# EasyEDA Pro project ProDoc_Custom Keyboard_2025-10-23_RV1.epro, board PCB3
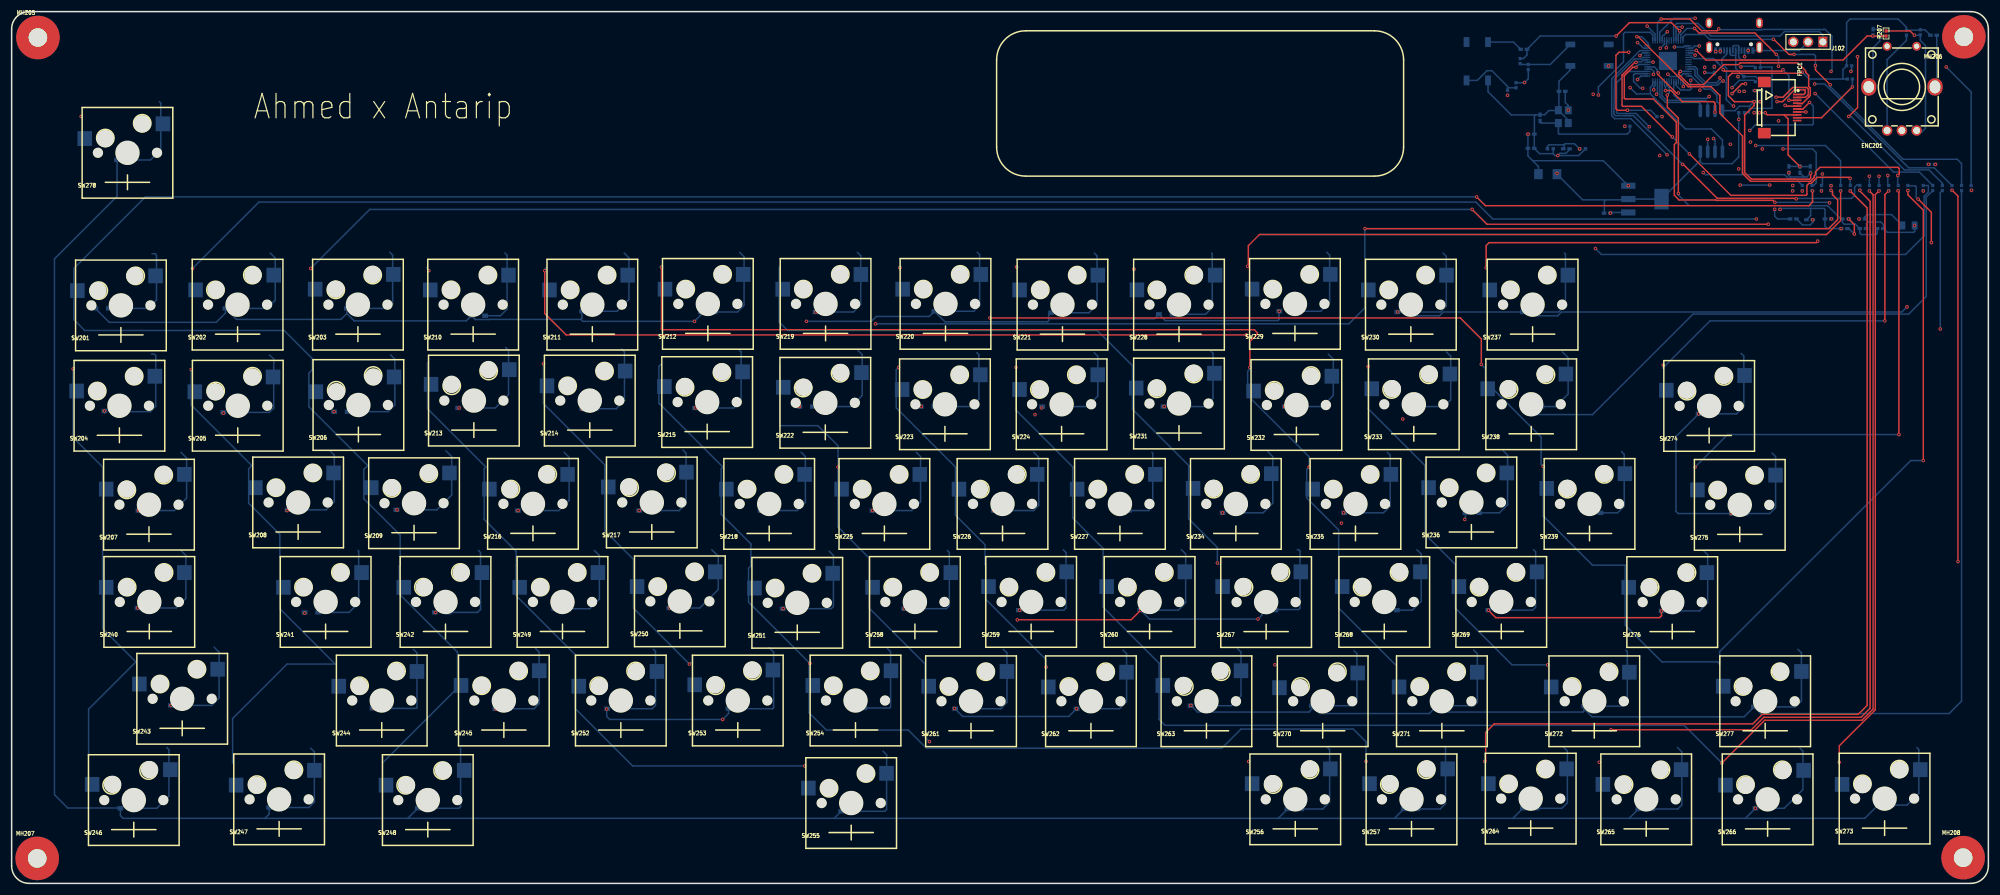
[diagram p2: board, top side]
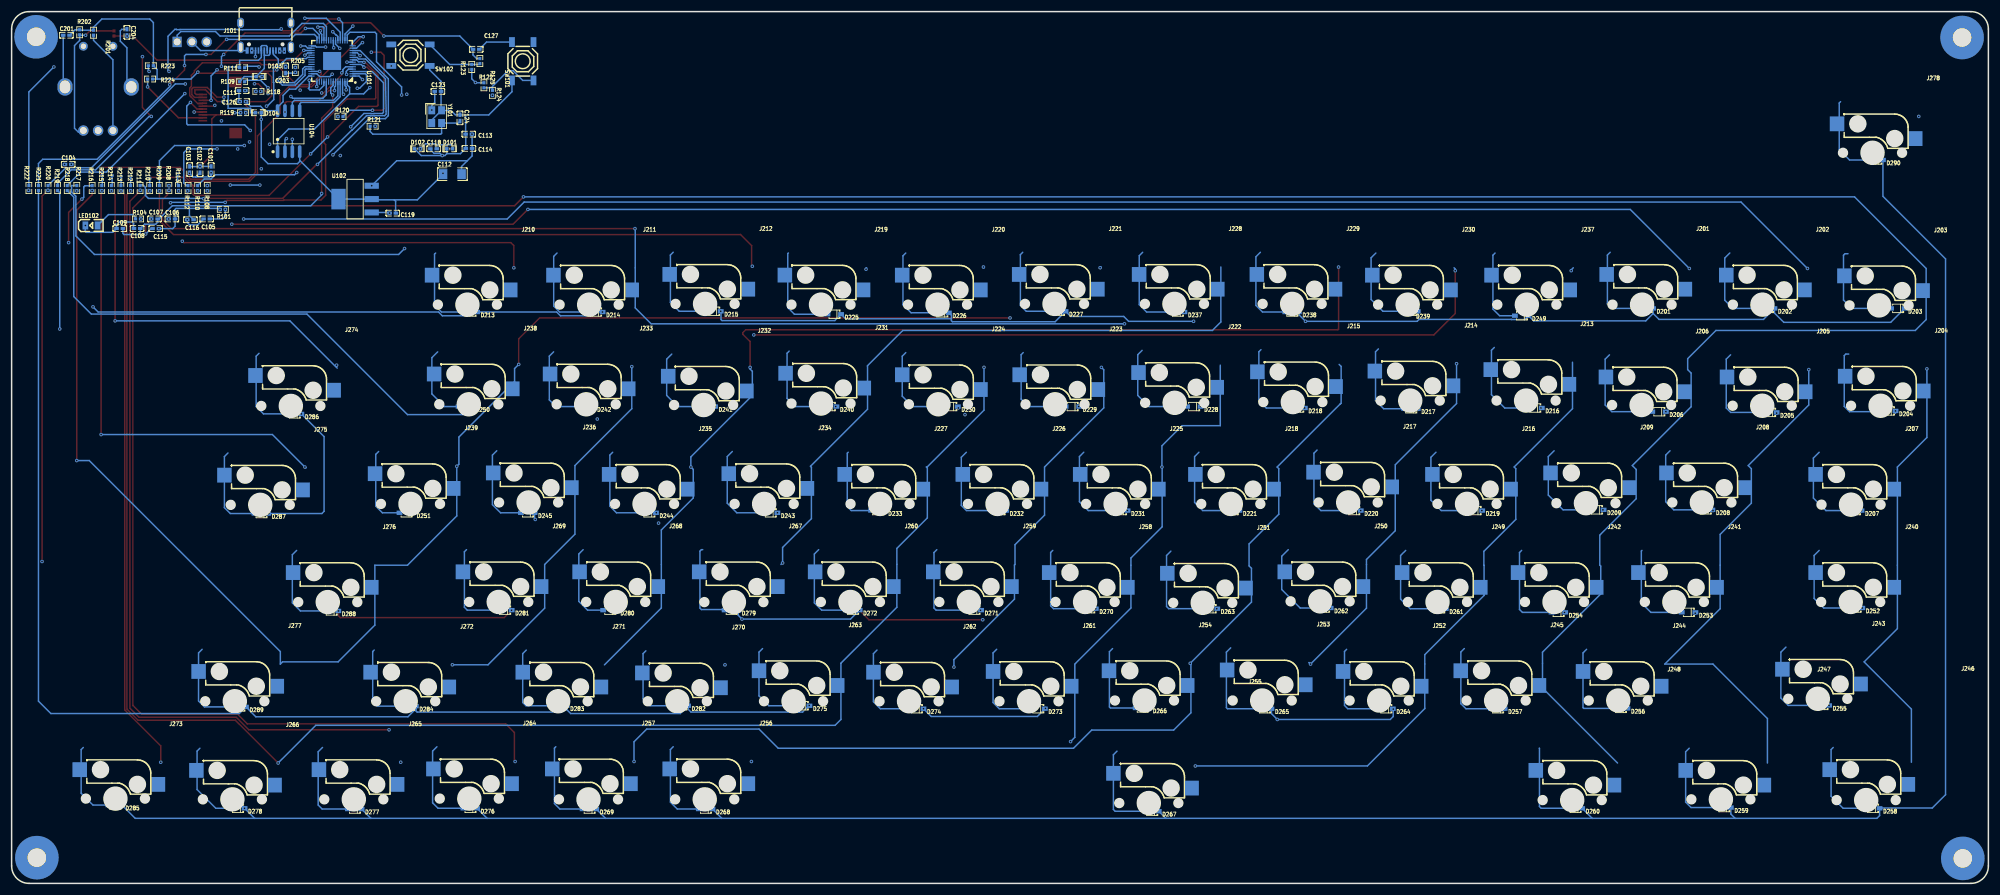
[diagram p3: board, bottom side, seen from below]

Outline 340 x 150 mm; copper layers: Top Layer, Inner1, Inner2, Bottom Layer. Coordinates in mm from the lower left corner of the outline.
Outline path: 0,147 0,3 arc(0.88,0.88) 3,0 337,0 arc(339.12,0.88) 340,3 340,147 arc(339.12,149.12) 337,150 3,150 arc(0.88,149.12) 0,147
Stack: Top Layer 0.035mm Outer layer thickness 1oz / Dielectric1 0.2104mm 7628 RC49% 8.6mil / Inner1 0.0152mm Inner layer thickness / Dielectric2 1.065mm 1.1mm H/HOZ Copper / Inner2 0.0152mm Inner layer thickness / Dielectric3 0.2104mm 7628 RC49% 8.6mil / Bottom Layer 0.035mm Outer layer thickness 1oz

## Design rules (mm)
net GND: DP2
net $2N1913: DP2
net SDA: DP1
net SCL: DP1
template: JLCPCB Capability(Two Layers Board)
spacing copperThickness1oz (default): track to track 0.102, other pairs 0.152 to 0.3
spacing copperThickness2oz: track to track 0.203, other pairs 0.152 to 0.3
track width copperThickness1oz (default): min 0.127, default 0.254, max 2.54
track width copperThickness2oz: min 0.203, default 0.254, max 2.54
differential pair differentialPair (default): width min 0.127, default 0.254, max 2.54; gap min 0.152, default 0.152
via viaSize (default): diameter min 0.5, default 0.61, max 10; hole min 0.3, default 0.305, max 6.3

## Placement (name value [footprint] x y rotation side)
C101  2.2uF  [C0402]  305.69 122.82 270 bottom
C102  100nF  [C0402]  307.59 122.82 270 bottom
C103  100nF  [C0402]  309.37 122.82 270 bottom
C104  100nF  [C0402]  330.27 123.73 180 bottom
C105  2.2uF  [C0402]  306.44 114.33 180 bottom
C106  2.2uF  [C0402]  312.44 114.33 180 bottom
C107  2.2uF  [C0402]  315.43 114.33 180 bottom
C108  100nF  [C0402]  318.42 112.68 180 bottom
C109  100nF  [C0402]  321.41 112.68 180 bottom
C111  1uF  [C0402]  300.36 136.41 180 bottom
C112  47uF  [C1206]  264.2 122.03 180 bottom
C113  100nF  [C0402]  261.37 128.92 180 bottom
C114  100nF  [C0402]  261.34 126.48 180 bottom
C115  100nF  [C0402]  315.21 112.66 180 bottom
C116  100nF  [C0402]  309.25 114.19 180 bottom
C118  1uF  [C0402]  267.43 126.4 180 bottom
C119  1uF  [C0402]  274.45 115.33 0 bottom
C123  15pF  [C0402]  266.68 136.28 180 bottom
C124  15pF  [C0402]  262.89 131.71 90 bottom
C126  100nF  [C0402]  300.23 134.51 180 bottom
C127  100nF  [C0402]  260.1 143.52 0 bottom
C201  2.2uF  [C0402]  330.58 145.94 180 bottom
C203  10nF  [C0402]  292.86 139.97 270 bottom
C204  10nF  [C0402]  320.17 146.44 270 bottom
D101  GG0402052R542P  [D0402-BI]  264.66 126.4 180 bottom
D102  GG0402052R542P  [D0402-BI]  270.2 126.4 180 bottom
D103  GG0402052R542P  [D0402-BI]  297.43 138.82 0 bottom
D104  GG0402052R542P  [D0402-BI]  297.56 132.6 0 bottom
D201  1N5819WS  [SOD-323_L1.8-W1.3-LS2.5-RD]  58.85 98.93 0 bottom
D202  1N5819WS  [SOD-323_L1.8-W1.3-LS2.5-RD]  37.96 98.93 0 bottom
D203  1N5819WS  [SOD-323_L1.8-W1.3-LS2.5-RD]  15.57 98.93 0 bottom
D204  1N5819WS  [SOD-323_L1.8-W1.3-LS2.5-RD]  17.14 81.29 0 bottom
D205  1N5819WS  [SOD-323_L1.8-W1.3-LS2.5-RD]  37.59 81.04 0 bottom
D206  1N5819WS  [SOD-323_L1.8-W1.3-LS2.5-RD]  56.64 81.17 0 bottom
D207  1N5819WS  [SOD-323_L1.8-W1.3-LS2.5-RD]  22.99 64.15 0 bottom
D208  1N5819WS  [SOD-323_L1.8-W1.3-LS2.5-RD]  48.64 64.28 0 bottom
D209  1N5819WS  [SOD-323_L1.8-W1.3-LS2.5-RD]  67.36 64.27 0 bottom
D213  1N5819WS  [SOD-323_L1.8-W1.3-LS2.5-RD]  261.11 98.31 0 bottom
D214  1N5819WS  [SOD-323_L1.8-W1.3-LS2.5-RD]  239.52 98.31 0 bottom
D215  1N5819WS  [SOD-323_L1.8-W1.3-LS2.5-RD]  219.2 98.44 0 bottom
D216  1N5819WS  [SOD-323_L1.8-W1.3-LS2.5-RD]  77.98 81.8 0 bottom
D217  1N5819WS  [SOD-323_L1.8-W1.3-LS2.5-RD]  99.31 81.67 0 bottom
D218  1N5819WS  [SOD-323_L1.8-W1.3-LS2.5-RD]  118.75 81.8 0 bottom
D219  1N5819WS  [SOD-323_L1.8-W1.3-LS2.5-RD]  88.24 64.15 0 bottom
D220  1N5819WS  [SOD-323_L1.8-W1.3-LS2.5-RD]  109.12 64.15 0 bottom
D221  1N5819WS  [SOD-323_L1.8-W1.3-LS2.5-RD]  130 64.15 0 bottom
D225  1N5819WS  [SOD-323_L1.8-W1.3-LS2.5-RD]  198.5 97.93 0 bottom
D226  1N5819WS  [SOD-323_L1.8-W1.3-LS2.5-RD]  179.96 98.18 0 bottom
D227  1N5819WS  [SOD-323_L1.8-W1.3-LS2.5-RD]  159.89 98.44 0 bottom
D228  1N5819WS  [SOD-323_L1.8-W1.3-LS2.5-RD]  136.66 82.04 0 bottom
D229  1N5819WS  [SOD-323_L1.8-W1.3-LS2.5-RD]  157.54 82.04 0 bottom
D230  1N5819WS  [SOD-323_L1.8-W1.3-LS2.5-RD]  178.42 82.04 0 bottom
D231  1N5819WS  [SOD-323_L1.8-W1.3-LS2.5-RD]  149.23 64.15 0 bottom
D232  1N5819WS  [SOD-323_L1.8-W1.3-LS2.5-RD]  170.11 64.15 0 bottom
D233  1N5819WS  [SOD-323_L1.8-W1.3-LS2.5-RD]  191 64.15 0 bottom
D237  1N5819WS  [SOD-323_L1.8-W1.3-LS2.5-RD]  139.45 98.31 0 bottom
D238  1N5819WS  [SOD-323_L1.8-W1.3-LS2.5-RD]  119.76 98.31 0 bottom
D239  1N5819WS  [SOD-323_L1.8-W1.3-LS2.5-RD]  99.31 98.44 0 bottom
D240  1N5819WS  [SOD-323_L1.8-W1.3-LS2.5-RD]  199.3 82.04 0 bottom
D241  1N5819WS  [SOD-323_L1.8-W1.3-LS2.5-RD]  220.19 82.04 0 bottom
D242  1N5819WS  [SOD-323_L1.8-W1.3-LS2.5-RD]  241.07 82.04 0 bottom
D243  1N5819WS  [SOD-323_L1.8-W1.3-LS2.5-RD]  209.46 63.77 0 bottom
D244  1N5819WS  [SOD-323_L1.8-W1.3-LS2.5-RD]  230.35 63.77 0 bottom
D245  1N5819WS  [SOD-323_L1.8-W1.3-LS2.5-RD]  251.23 63.77 0 bottom
D249  1N5819WS  [SOD-323_L1.8-W1.3-LS2.5-RD]  80.26 97.68 0 bottom
D250  1N5819WS  [SOD-323_L1.8-W1.3-LS2.5-RD]  261.95 82.04 0 bottom
D251  1N5819WS  [SOD-323_L1.8-W1.3-LS2.5-RD]  272.11 63.77 0 bottom
D252  1N5819WS  [SOD-323_L1.8-W1.3-LS2.5-RD]  22.86 47.38 0 bottom
D253  1N5819WS  [SOD-323_L1.8-W1.3-LS2.5-RD]  51.56 46.63 0 bottom
D254  1N5819WS  [SOD-323_L1.8-W1.3-LS2.5-RD]  73.96 46.63 0 bottom
D255  1N5819WS  [SOD-323_L1.8-W1.3-LS2.5-RD]  28.57 30.62 0 bottom
D256  1N5819WS  [SOD-323_L1.8-W1.3-LS2.5-RD]  63.25 30.11 0 bottom
D257  1N5819WS  [SOD-323_L1.8-W1.3-LS2.5-RD]  84.37 30.05 0 bottom
D258  1N5819WS  [SOD-323_L1.8-W1.3-LS2.5-RD]  19.88 12.92 0 bottom
D259  1N5819WS  [SOD-323_L1.8-W1.3-LS2.5-RD]  45.47 13.05 0 bottom
D260  1N5819WS  [SOD-323_L1.8-W1.3-LS2.5-RD]  71.04 12.92 0 bottom
D261  1N5819WS  [SOD-323_L1.8-W1.3-LS2.5-RD]  94.49 47.26 0 bottom
D262  1N5819WS  [SOD-323_L1.8-W1.3-LS2.5-RD]  114.3 47.38 0 bottom
D263  1N5819WS  [SOD-323_L1.8-W1.3-LS2.5-RD]  133.81 47.27 0 bottom
D264  1N5819WS  [SOD-323_L1.8-W1.3-LS2.5-RD]  103.6 30.05 0 bottom
D265  1N5819WS  [SOD-323_L1.8-W1.3-LS2.5-RD]  124.48 30.05 0 bottom
D266  1N5819WS  [SOD-323_L1.8-W1.3-LS2.5-RD]  145.49 30.18 0 bottom
D267  1N5819WS  [SOD-323_L1.8-W1.3-LS2.5-RD]  143.86 12.41 0 bottom
D268  1N5819WS  [SOD-323_L1.8-W1.3-LS2.5-RD]  220.62 12.79 0 bottom
D269  1N5819WS  [SOD-323_L1.8-W1.3-LS2.5-RD]  240.62 12.79 0 bottom
D270  1N5819WS  [SOD-323_L1.8-W1.3-LS2.5-RD]  154.69 47.27 0 bottom
D271  1N5819WS  [SOD-323_L1.8-W1.3-LS2.5-RD]  174.43 47.01 0 bottom
D272  1N5819WS  [SOD-323_L1.8-W1.3-LS2.5-RD]  195.31 47.01 0 bottom
D273  1N5819WS  [SOD-323_L1.8-W1.3-LS2.5-RD]  163.46 30.05 0 bottom
D274  1N5819WS  [SOD-323_L1.8-W1.3-LS2.5-RD]  184.34 30.05 0 bottom
D275  1N5819WS  [SOD-323_L1.8-W1.3-LS2.5-RD]  203.95 30.56 0 bottom
D276  1N5819WS  [SOD-323_L1.8-W1.3-LS2.5-RD]  261.12 12.92 0 bottom
D277  1N5819WS  [SOD-323_L1.8-W1.3-LS2.5-RD]  280.98 12.79 0 bottom
D278  1N5819WS  [SOD-323_L1.8-W1.3-LS2.5-RD]  301.1 12.92 0 bottom
D279  1N5819WS  [SOD-323_L1.8-W1.3-LS2.5-RD]  216.2 47.01 0 bottom
D280  1N5819WS  [SOD-323_L1.8-W1.3-LS2.5-RD]  237.08 47.01 0 bottom
D281  1N5819WS  [SOD-323_L1.8-W1.3-LS2.5-RD]  255.17 47.01 0 bottom
D282  1N5819WS  [SOD-323_L1.8-W1.3-LS2.5-RD]  224.83 30.56 0 bottom
D283  1N5819WS  [SOD-323_L1.8-W1.3-LS2.5-RD]  245.71 30.56 0 bottom
D284  1N5819WS  [SOD-323_L1.8-W1.3-LS2.5-RD]  271.65 30.49 0 bottom
D285  1N5819WS  [SOD-323_L1.8-W1.3-LS2.5-RD]  322.2 13.47 0 bottom
D286  1N5819WS  [SOD-323_L1.8-W1.3-LS2.5-RD]  291.34 80.78 0 bottom
D287  1N5819WS  [SOD-323_L1.8-W1.3-LS2.5-RD]  297.05 63.64 0 bottom
D288  1N5819WS  [SOD-323_L1.8-W1.3-LS2.5-RD]  284.99 46.88 0 bottom
D289  1N5819WS  [SOD-323_L1.8-W1.3-LS2.5-RD]  300.86 30.37 0 bottom
D290  1N5819WS  [SOD-323_L1.8-W1.3-LS2.5-RD]  19.3 124.47 0 bottom
ENC201  PEC12R-4120F-S0012  [SW-TH_PEC12R-4120F-S0012_1]  325.12 136.79 0 top
FPC1  FH28-10S-0.5SH(05)  [FFC-SMD_10P-P0.50_FH28-10S-0.5SH-05]  304.29 133.49 270 top
J101  TYPE-C 16PIN 2MD(073)  [USB-C-SMD_TYPE-C-6PIN-2MD-073]  296.29 145.68 0 bottom
J102  2.54-1*3P针  [HDR-TH_3P-P2.54-V-M-1]  308.99 144.79 180 top
J201  CPG151101S11-16  [SMD_KEYBOARD-SW_1]  58.93 103.51 0 bottom
J202  CPG151101S11-16  [SMD_KEYBOARD-SW_1]  38.35 103.39 0 bottom
J203  CPG151101S11-16  [SMD_KEYBOARD-SW_1]  18.03 103.26 0 bottom
J204  CPG151101S11-16  [SMD_KEYBOARD-SW_1]  17.91 85.99 0 bottom
J205  CPG151101S11-16  [SMD_KEYBOARD-SW_1]  38.23 85.86 0 bottom
J206  CPG151101S11-16  [SMD_KEYBOARD-SW_1]  59.05 85.86 0 bottom
J207  CPG151101S11-16  [SMD_KEYBOARD-SW_1]  22.99 69.1 0 bottom
J208  CPG151101S11-16  [SMD_KEYBOARD-SW_1]  48.64 69.36 0 bottom
J209  CPG151101S11-16  [SMD_KEYBOARD-SW_1]  68.58 69.36 0 bottom
J210  CPG151101S11-16  [SMD_KEYBOARD-SW_1]  260.96 103.38 0 bottom
J211  CPG151101S11-16  [SMD_KEYBOARD-SW_1]  240.07 103.38 0 bottom
J212  CPG151101S11-16  [SMD_KEYBOARD-SW_1]  220.09 103.52 0 bottom
J213  CPG151101S11-16  [SMD_KEYBOARD-SW_1]  78.87 87.14 0 bottom
J214  CPG151101S11-16  [SMD_KEYBOARD-SW_1]  98.81 86.88 0 bottom
J215  CPG151101S11-16  [SMD_KEYBOARD-SW_1]  119 86.75 0 bottom
J216  CPG151101S11-16  [SMD_KEYBOARD-SW_1]  88.9 69.1 0 bottom
J217  CPG151101S11-16  [SMD_KEYBOARD-SW_1]  109.35 69.48 0 bottom
J218  CPG151101S11-16  [SMD_KEYBOARD-SW_1]  129.67 69.1 0 bottom
J219  CPG151101S11-16  [SMD_KEYBOARD-SW_1]  200.28 103.39 0 bottom
J220  CPG151101S11-16  [SMD_KEYBOARD-SW_1]  180.1 103.38 0 bottom
J221  CPG151101S11-16  [SMD_KEYBOARD-SW_1]  159.98 103.51 0 bottom
J222  CPG151101S11-16  [SMD_KEYBOARD-SW_1]  139.45 86.63 0 bottom
J223  CPG151101S11-16  [SMD_KEYBOARD-SW_1]  159.89 86.25 0 bottom
J224  CPG151101S11-16  [SMD_KEYBOARD-SW_1]  180.09 86.25 0 bottom
J225  CPG151101S11-16  [SMD_KEYBOARD-SW_1]  149.48 69.1 0 bottom
J226  CPG151101S11-16  [SMD_KEYBOARD-SW_1]  169.67 69.1 0 bottom
J227  CPG151101S11-16  [SMD_KEYBOARD-SW_1]  189.99 69.1 0 bottom
J228  CPG151101S11-16  [SMD_KEYBOARD-SW_1]  139.35 103.51 0 bottom
J229  CPG151101S11-16  [SMD_KEYBOARD-SW_1]  119.1 103.51 0 bottom
J230  CPG151101S11-16  [SMD_KEYBOARD-SW_1]  99.23 103.38 0 bottom
J231  CPG151101S11-16  [SMD_KEYBOARD-SW_1]  200.15 86.5 0 bottom
J232  CPG151101S11-16  [SMD_KEYBOARD-SW_1]  220.34 85.99 0 bottom
J233  CPG151101S11-16  [SMD_KEYBOARD-SW_1]  240.66 86.37 0 bottom
J234  CPG151101S11-16  [SMD_KEYBOARD-SW_1]  209.93 69.23 0 bottom
J235  CPG151101S11-16  [SMD_KEYBOARD-SW_1]  230.5 69.1 0 bottom
J236  CPG151101S11-16  [SMD_KEYBOARD-SW_1]  250.44 69.36 0 bottom
J237  CPG151101S11-16  [SMD_KEYBOARD-SW_1]  78.73 103.38 0 bottom
J238  CPG151101S11-16  [SMD_KEYBOARD-SW_1]  260.6 86.37 0 bottom
J239  CPG151101S11-16  [SMD_KEYBOARD-SW_1]  270.76 69.23 0 bottom
J240  CPG151101S11-16  [SMD_KEYBOARD-SW_1]  22.99 52.21 0 bottom
J241  CPG151101S11-16  [SMD_KEYBOARD-SW_1]  53.47 52.21 0 bottom
J242  CPG151101S11-16  [SMD_KEYBOARD-SW_1]  74.17 52.21 0 bottom
J243  CPG151101S11-16  [SMD_KEYBOARD-SW_1]  28.7 35.57 0 bottom
J244  CPG151101S11-16  [SMD_KEYBOARD-SW_1]  62.99 35.19 0 bottom
J245  CPG151101S11-16  [SMD_KEYBOARD-SW_1]  84.02 35.32 0 bottom
J246  CPG151101S11-16  [SMD_KEYBOARD-SW_1]  20.57 18.3 0 bottom
J247  CPG151101S11-16  [SMD_KEYBOARD-SW_1]  45.34 18.17 0 bottom
J248  CPG151101S11-16  [SMD_KEYBOARD-SW_1]  71.12 18.17 0 bottom
J249  CPG151101S11-16  [SMD_KEYBOARD-SW_1]  94.11 52.21 0 bottom
J250  CPG151101S11-16  [SMD_KEYBOARD-SW_1]  114.3 52.34 0 bottom
J251  CPG151101S11-16  [SMD_KEYBOARD-SW_1]  134.49 52.08 0 bottom
J252  CPG151101S11-16  [SMD_KEYBOARD-SW_1]  104.27 35.19 0 bottom
J253  CPG151101S11-16  [SMD_KEYBOARD-SW_1]  124.21 35.45 0 bottom
J254  CPG151101S11-16  [SMD_KEYBOARD-SW_1]  144.53 35.32 0 bottom
J255  CPG151101S11-16  [SMD_KEYBOARD-SW_1]  143.76 17.67 0 bottom
J256  CPG151101S11-16  [SMD_KEYBOARD-SW_1]  220.09 18.43 0 bottom
J257  CPG151101S11-16  [SMD_KEYBOARD-SW_1]  240.28 18.43 0 bottom
J258  CPG151101S11-16  [SMD_KEYBOARD-SW_1]  154.81 52.21 0 bottom
J259  CPG151101S11-16  [SMD_KEYBOARD-SW_1]  174.75 52.34 0 bottom
J260  CPG151101S11-16  [SMD_KEYBOARD-SW_1]  195.07 52.34 0 bottom
J261  CPG151101S11-16  [SMD_KEYBOARD-SW_1]  164.47 35.19 0 bottom
J262  CPG151101S11-16  [SMD_KEYBOARD-SW_1]  185.04 35.06 0 bottom
J263  CPG151101S11-16  [SMD_KEYBOARD-SW_1]  204.72 35.32 0 bottom
J264  CPG151101S11-16  [SMD_KEYBOARD-SW_1]  260.73 18.43 0 bottom
J265  CPG151101S11-16  [SMD_KEYBOARD-SW_1]  280.42 18.3 0 bottom
J266  CPG151101S11-16  [SMD_KEYBOARD-SW_1]  301.5 18.17 0 bottom
J267  CPG151101S11-16  [SMD_KEYBOARD-SW_1]  215.01 52.34 0 bottom
J268  CPG151101S11-16  [SMD_KEYBOARD-SW_1]  235.59 52.34 0 bottom
J269  CPG151101S11-16  [SMD_KEYBOARD-SW_1]  255.65 52.34 0 bottom
J270  CPG151101S11-16  [SMD_KEYBOARD-SW_1]  224.79 34.94 0 bottom
J271  CPG151101S11-16  [SMD_KEYBOARD-SW_1]  245.36 35.06 0 bottom
J272  CPG151101S11-16  [SMD_KEYBOARD-SW_1]  271.53 35.06 0 bottom
J273  CPG151101S11-16  [SMD_KEYBOARD-SW_1]  321.56 18.3 0 bottom
J274  CPG151101S11-16  [SMD_KEYBOARD-SW_1]  291.34 86.12 0 bottom
J275  CPG151101S11-16  [SMD_KEYBOARD-SW_1]  296.67 68.97 0 bottom
J276  CPG151101S11-16  [SMD_KEYBOARD-SW_1]  284.86 52.21 0 bottom
J277  CPG151101S11-16  [SMD_KEYBOARD-SW_1]  301.12 35.19 0 bottom
J278  CPG151101S11-16  [SMD_KEYBOARD-SW_1]  19.3 129.43 0 bottom
LED102  KT-0805G  [LED0805-R-RD]  326.27 113.21 180 bottom
MH205  -  [MH_7.5X3.2MM_RF_v1.0]  4.52 145.54 0 top
MH206  -  [MH_7.5X3.2MM_RF_v1.0]  335.79 145.67 0 top
MH207  -  [MH_7.5X3.2MM_RF_v1.0]  4.4 4.3 0 top
MH208  -  [MH_7.5X3.2MM_RF_v1.0]  335.66 4.42 0 top
R101  200Ω  [R0402]  303.67 115.98 180 bottom
R104  1kΩ  [R0402]  318.26 114.33 180 bottom
R108  27Ω  [R0402]  306.35 119.65 270 bottom
R109  27Ω  [R0402]  300.36 137.94 180 bottom
R110  27Ω  [R0402]  308 119.65 270 bottom
R111  27Ω  [R0402]  300.36 140.35 180 bottom
R112  27Ω  [R0402]  309.65 119.65 270 bottom
R113  27Ω  [R0402]  311.3 119.65 270 bottom
R118  5.1kΩ  [R0402]  297.56 136.28 180 bottom
R119  5.1kΩ  [R0402]  300.19 132.6 180 bottom
R120  1MΩ  [R0402]  283.44 131.93 180 bottom
R121  1kΩ  [R0402]  277.91 130.28 180 bottom
R122  100kΩ  [R0402]  258.76 137.32 90 bottom
R123  10kΩ  [R0402]  260.86 140.47 270 bottom
R124  1kΩ  [R0402]  257.3 136.03 270 bottom
R125  27Ω  [R0402]  259.46 141.49 90 bottom
R201  10kΩ  [R0402]  325.91 146.37 90 bottom
R202  10kΩ  [R0402]  328.3 146.44 90 bottom
R205  10kΩ  [R0402]  291.21 139.97 90 bottom
R207  10kΩ  [R0402]  322.4 146.24 90 top
R208  27Ω  [R0402]  312.95 119.65 270 bottom
R209  27Ω  [R0402]  314.6 119.65 270 bottom
R210  27Ω  [R0402]  316.25 119.65 270 bottom
R211  27Ω  [R0402]  317.9 119.65 270 bottom
R212  27Ω  [R0402]  319.55 119.65 270 bottom
R213  27Ω  [R0402]  321.2 119.65 270 bottom
R214  27Ω  [R0402]  322.85 119.65 270 bottom
R215  27Ω  [R0402]  324.5 119.65 270 bottom
R216  27Ω  [R0402]  326.15 119.65 270 bottom
R217  27Ω  [R0402]  328.79 119.65 270 bottom
R218  27Ω  [R0402]  330.44 119.65 270 bottom
R219  27Ω  [R0402]  332.09 119.65 270 bottom
R220  27Ω  [R0402]  333.74 119.65 270 bottom
R221  27Ω  [R0402]  335.38 119.65 270 bottom
R222  27Ω  [R0402]  337.03 119.65 270 bottom
R223  10kΩ  [R0402]  316.05 140.69 180 bottom
R224  10kΩ  [R0402]  316.18 138.4 180 bottom
SW101  TS-1187A-B-A-B  [SW-SMD_4P-L5.1-W5.1-P3.70-LS6.5-TL-2]  252.09 141.46 90 bottom
SW102  TS-1187A-B-A-B  [SW-SMD_4P-L5.1-W5.1-P3.70-LS6.5-TL-2]  271.4 142.51 0 bottom
SW201  CPG151101S21  [KEY-TH_CPG1511F01S0X_1]  18.16 103.26 0 top
SW202  CPG151101S21  [KEY-TH_CPG1511F01S0X_1]  38.23 103.39 0 top
SW203  CPG151101S21  [KEY-TH_CPG1511F01S0X_1]  58.93 103.39 0 top
SW204  CPG151101S21  [KEY-TH_CPG1511F01S0X_1]  17.91 85.99 0 top
SW205  CPG151101S21  [KEY-TH_CPG1511F01S0X_1]  38.26 86 0 top
SW206  CPG151101S21  [KEY-TH_CPG1511F01S0X_1]  59.01 86.12 0 top
SW207  CPG151101S21  [KEY-TH_CPG1511F01S0X_1]  22.99 68.97 0 top
SW208  CPG151101S21  [KEY-TH_CPG1511F01S0X_1]  48.64 69.36 0 top
SW209  CPG151101S21  [KEY-TH_CPG1511F01S0X_1]  68.58 69.23 0 top
SW210  CPG151101S21  [KEY-TH_CPG1511F01S0X_1]  78.75 103.39 0 top
SW211  CPG151101S21  [KEY-TH_CPG1511F01S0X_1]  99.25 103.39 0 top
SW212  CPG151101S21  [KEY-TH_CPG1511F01S0X_1]  119.11 103.52 0 top
SW213  CPG151101S21  [KEY-TH_CPG1511F01S0X_1]  78.87 86.88 0 top
SW214  CPG151101S21  [KEY-TH_CPG1511F01S0X_1]  98.81 86.88 0 top
SW215  CPG151101S21  [KEY-TH_CPG1511F01S0X_1]  119 86.63 0 top
SW216  CPG151101S21  [KEY-TH_CPG1511F01S0X_1]  89.03 69.11 0 top
SW217  CPG151101S21  [KEY-TH_CPG1511F01S0X_1]  109.47 69.36 0 top
SW218  CPG151101S21  [KEY-TH_CPG1511F01S0X_1]  129.67 69.1 0 top
SW219  CPG151101S21  [KEY-TH_CPG1511F01S0X_1]  139.36 103.52 0 top
SW220  CPG151101S21  [KEY-TH_CPG1511F01S0X_1]  159.99 103.52 0 top
SW221  CPG151101S21  [KEY-TH_CPG1511F01S0X_1]  180.11 103.39 0 top
SW222  CPG151101S21  [KEY-TH_CPG1511F01S0X_1]  139.32 86.5 0 top
SW223  CPG151101S21  [KEY-TH_CPG1511F01S0X_1]  159.89 86.25 0 top
SW224  CPG151101S21  [KEY-TH_CPG1511F01S0X_1]  179.96 86.25 0 top
SW225  CPG151101S21  [KEY-TH_CPG1511F01S0X_1]  149.48 69.1 0 top
SW226  CPG151101S21  [KEY-TH_CPG1511F01S0X_1]  169.8 69.1 0 top
SW227  CPG151101S21  [KEY-TH_CPG1511F01S0X_1]  189.99 69.1 0 top
SW228  CPG151101S21  [KEY-TH_CPG1511F01S0X_1]  200.15 103.39 0 top
SW229  CPG151101S21  [KEY-TH_CPG1511F01S0X_1]  220.09 103.52 0 top
SW230  CPG151101S21  [KEY-TH_CPG1511F01S0X_1]  240.03 103.39 0 top
SW231  CPG151101S21  [KEY-TH_CPG1511F01S0X_1]  200.15 86.37 0 top
SW232  CPG151101S21  [KEY-TH_CPG1511F01S0X_1]  220.34 86.12 0 top
SW233  CPG151101S21  [KEY-TH_CPG1511F01S0X_1]  240.54 86.25 0 top
SW234  CPG151101S21  [KEY-TH_CPG1511F01S0X_1]  209.93 69.1 0 top
SW235  CPG151101S21  [KEY-TH_CPG1511F01S0X_1]  230.5 69.1 0 top
SW236  CPG151101S21  [KEY-TH_CPG1511F01S0X_1]  250.44 69.36 0 top
SW237  CPG151101S21  [KEY-TH_CPG1511F01S0X_1]  260.97 103.39 0 top
SW238  CPG151101S21  [KEY-TH_CPG1511F01S0X_1]  260.73 86.25 0 top
SW239  CPG151101S21  [KEY-TH_CPG1511F01S0X_1]  270.76 69.1 0 top
SW240  CPG151101S21  [KEY-TH_CPG1511F01S0X_1]  23.05 52.23 0 top
SW241  CPG151101S21  [KEY-TH_CPG1511F01S0X_1]  53.37 52.23 0 top
SW242  CPG151101S21  [KEY-TH_CPG1511F01S0X_1]  73.99 52.23 0 top
SW243  CPG151101S21  [KEY-TH_CPG1511F01S0X_1]  28.7 35.57 0 top
SW244  CPG151101S21  [KEY-TH_CPG1511F01S0X_1]  63.03 35.28 0 top
SW245  CPG151101S21  [KEY-TH_CPG1511F01S0X_1]  84.03 35.28 0 top
SW246  CPG151101S21  [KEY-TH_CPG1511F01S0X_1]  20.38 18.14 0 top
SW247  CPG151101S21  [KEY-TH_CPG1511F01S0X_1]  45.37 18.27 0 top
SW248  CPG151101S21  [KEY-TH_CPG1511F01S0X_1]  70.95 18.14 0 top
SW249  CPG151101S21  [KEY-TH_CPG1511F01S0X_1]  94.11 52.23 0 top
SW250  CPG151101S21  [KEY-TH_CPG1511F01S0X_1]  114.3 52.34 0 top
SW251  CPG151101S21  [KEY-TH_CPG1511F01S0X_1]  134.49 52.08 0 top
SW252  CPG151101S21  [KEY-TH_CPG1511F01S0X_1]  104.15 35.28 0 top
SW253  CPG151101S21  [KEY-TH_CPG1511F01S0X_1]  124.27 35.28 0 top
SW254  CPG151101S21  [KEY-TH_CPG1511F01S0X_1]  144.51 35.28 0 top
SW255  CPG151101S21  [KEY-TH_CPG1511F01S0X_1]  143.77 17.63 0 top
SW256  CPG151101S21  [KEY-TH_CPG1511F01S0X_1]  220.15 18.27 0 top
SW257  CPG151101S21  [KEY-TH_CPG1511F01S0X_1]  240.14 18.27 0 top
SW258  CPG151101S21  [KEY-TH_CPG1511F01S0X_1]  154.73 52.23 0 top
SW259  CPG151101S21  [KEY-TH_CPG1511F01S0X_1]  174.72 52.23 0 top
SW260  CPG151101S21  [KEY-TH_CPG1511F01S0X_1]  195.09 52.23 0 top
SW261  CPG151101S21  [KEY-TH_CPG1511F01S0X_1]  164.38 35.15 0 top
SW262  CPG151101S21  [KEY-TH_CPG1511F01S0X_1]  185.01 35.15 0 top
SW263  CPG151101S21  [KEY-TH_CPG1511F01S0X_1]  204.87 35.15 0 top
SW264  CPG151101S21  [KEY-TH_CPG1511F01S0X_1]  260.65 18.4 0 top
SW265  CPG151101S21  [KEY-TH_CPG1511F01S0X_1]  280.51 18.27 0 top
SW266  CPG151101S21  [KEY-TH_CPG1511F01S0X_1]  301.39 18.27 0 top
SW267  CPG151101S21  [KEY-TH_CPG1511F01S0X_1]  215.14 52.21 0 top
SW268  CPG151101S21  [KEY-TH_CPG1511F01S0X_1]  235.46 52.23 0 top
SW269  CPG151101S21  [KEY-TH_CPG1511F01S0X_1]  255.58 52.23 0 top
SW270  CPG151101S21  [KEY-TH_CPG1511F01S0X_1]  224.87 35.15 0 top
SW271  CPG151101S21  [KEY-TH_CPG1511F01S0X_1]  245.37 35.15 0 top
SW272  CPG151101S21  [KEY-TH_CPG1511F01S0X_1]  271.58 35.15 0 top
SW273  CPG151101S21  [KEY-TH_CPG1511F01S0X_1]  321.51 18.4 0 top
SW274  CPG151101S21  [KEY-TH_CPG1511F01S0X_1]  291.34 85.96 0 top
SW275  CPG151101S21  [KEY-TH_CPG1511F01S0X_1]  296.6 68.94 0 top
SW276  CPG151101S21  [KEY-TH_CPG1511F01S0X_1]  284.99 52.21 0 top
SW277  CPG151101S21  [KEY-TH_CPG1511F01S0X_1]  300.98 35.15 0 top
SW278  CPG151101S21  [KEY-TH_CPG1511F01S0X_1]  19.29 129.52 0 top
U101  RP2040  [LQFN-56_L7.0-W7.0-P0.4-EP_1]  284.88 141.51 0 bottom
U102  LM3940IMP-3.3/NOPB  [SOT-223_L6.5-W3.5-P2.30-LS7.0-BR]  280.92 117.74 180 bottom
U104  W25Q128JVSIQ  [SOIC-8_L5.3-W5.3-P1.27-LS8.0-BL]  292.35 129.43 180 bottom
Y101  ABM8-272-T3  [CRYSTAL-SMD_4P-L3.2-W2.5-BL]  266.89 131.93 270 bottom

## Footprints (pads in the part's own frame, mm; a bottom-side part is the same pattern mirrored in y, then rotated)
C0402
  rect 0.79x0.54 smd: 1(-0.545,0) 2(0.545,0)
C1206
  rect 1.485x1.728 smd: 1(-1.593,0) 2(1.593,0)
CRYSTAL-SMD_4P-L3.2-W2.5-BL
  rect 1.4x1.2 smd: 1(-1.1,-0.85) 2(1.1,-0.85) 3(1.1,0.85) 4(-1.1,0.85)
D0402-BI
  rect 0.6x0.6 smd: 1(-0.5,0) 2(0.5,0)
FFC-SMD_10P-P0.50_FH28-10S-0.5SH-05
  rect 0.3x1.5 smd: 1(-2.25,2.825) 2(-1.75,2.825) 3(-1.25,2.825) 4(-0.75,2.825) 5(-0.25,2.825) 6(0.25,2.825) 7(0.75,2.825) 8(1.25,2.825) 9(1.75,2.825) 10(2.25,2.825)
  rect 1.8x2.2 smd: 11(4.4,-2.825) 12(-4.4,-2.825)
HDR-TH_3P-P2.54-V-M-1
  rect 1.575x1.8 hole 1.2: 1(-2.54,0)
  round 1.8 hole 1.2: 2(0,0) 3(2.54,0)
LED0805-R-RD
  rect 1x1.399 smd: 1(1.05,0) 2(-1.05,0)
LQFN-56_L7.0-W7.0-P0.4-EP_1
  rect 1.1x0.2 smd: 1(-3.55,2.6) 2(-3.55,2.2) 3(-3.55,1.8) 4(-3.55,1.4) 5(-3.55,1) 6(-3.55,0.6) 7(-3.55,0.2) 8(-3.55,-0.2) 9(-3.55,-0.6) 10(-3.55,-1) 11(-3.55,-1.4) 12(-3.55,-1.8) 13(-3.55,-2.2) 14(-3.55,-2.6) 29(3.55,-2.6) 30(3.55,-2.2) 31(3.55,-1.8) 32(3.55,-1.4) 33(3.55,-1) 34(3.55,-0.6) 35(3.55,-0.2) 36(3.55,0.2) 37(3.55,0.6) 38(3.55,1) 39(3.55,1.4) 40(3.55,1.8) 41(3.55,2.2) 42(3.55,2.6)
  rect 0.2x1.1 smd: 15(-2.6,-3.55) 16(-2.2,-3.55) 17(-1.8,-3.55) 18(-1.4,-3.55) 19(-1,-3.55) 20(-0.6,-3.55) 21(-0.2,-3.55) 22(0.2,-3.55) 23(0.6,-3.55) 24(1,-3.55) 25(1.4,-3.55) 26(1.8,-3.55) 27(2.2,-3.55) 28(2.6,-3.55) 43(2.6,3.55) 44(2.2,3.55) 45(1.8,3.55) 46(1.4,3.55) 47(1,3.55) 48(0.6,3.55) 49(0.2,3.55) 50(-0.2,3.55) 51(-0.6,3.55) 52(-1,3.55) 53(-1.4,3.55) 54(-1.8,3.55) 55(-2.2,3.55) 56(-2.6,3.55)
  rect 3.1x3.1 smd: 57(0,0)
MH_7.5X3.2MM_RF_v1.0
  round 7.5 hole 3.2: 1(0,0)
R0402
  rect 0.566x0.54 smd: 1(-0.433,0) 2(0.433,0)
SMD_KEYBOARD-SW_1
  rect 2.5x2.55 smd: 1(-6.725,1.27) 2(6.725,-1.27)
SOD-323_L1.8-W1.3-LS2.5-RD
  rect 1x0.75 smd: 1(-1.173,0) 2(1.173,0)
SOIC-8_L5.3-W5.3-P1.27-LS8.0-BL
  oval 0.63x2.25 smd: 1(-1.905,-3.53) 2(-0.635,-3.53) 3(0.635,-3.53) 4(1.905,-3.53) 5(1.905,3.53) 6(0.635,3.53) 7(-0.635,3.53) 8(-1.905,3.53)
SOT-223_L6.5-W3.5-P2.30-LS7.0-BR
  rect 2.465x1.05 smd: 1(2.857,-2.3) 2(2.857,0) 3(2.857,2.3)
  rect 2.465x3.54 smd: 4(-2.857,0)
SW-SMD_4P-L5.1-W5.1-P3.70-LS6.5-TL-2
  rect 1.7x1 smd: 1(-3.3,1.85) 2(3.3,1.85) 3(-3.3,-1.85) 4(3.3,-1.85)
SW-TH_PEC12R-4120F-S0012_1
  round 1.524 hole 0.914: 1(-2.54,7.25) 2(2.54,7.25)
  oval 2.6x3 hole 1.8x2.2: 3(5.7,0.25)
  oval 2.6x3 hole 1.8x2: 4(-5.7,0.25)
  round 1.8 hole 1.2: A(-2.54,-7.25) B(2.54,-7.25) C(0,-7.25)
USB-C-SMD_TYPE-C-6PIN-2MD-073
  rect 0.55x1.1 smd: 1(-3.2,2.375) 2(-2.4,2.375) 11(2.4,2.375) 12(3.2,2.375)
  rect 0.3x1.1 smd: 3(-1.75,2.375) 4(-1.25,2.375) 5(-0.75,2.375) 6(-0.25,2.375) 7(0.25,2.375) 8(0.75,2.375) 9(1.25,2.375) 10(1.75,2.375)
  oval 1.2x1.8 hole 0.6x1.2: 13(-4.325,-2.375) 14(4.325,-2.375)
  oval 1.1x2 hole 0.6x1.5: 13(-4.325,1.825) 14(4.325,1.825)

## Nets
As in the schematic.

Pads without a net: ENC201 1 2; FPC1 11 12; J101 3 9; U101 35 36 37

## Via types
v1: diameter 0.61, hole 0.305, Top Layer to Bottom Layer, 281 vias

## Routing (per net, layer and track width the routed paths; a pad name or vN(x,y) marks a point on that pad's centre or on a via; arc(x,y) is an arc through that point)
+1V1: length 59.3
  Top Layer w0.254: v1(284.78,135.65) 284.78,133.57 286.68,131.67 v1(286.68,118.72)
  Bottom Layer w0.254: v1(286.68,118.72) 286.68,118.46 288.54,116.6 312.36,116.6 314.63,114.33 C107.2 314.88,113.75 315.21,113.42 317.13,113.42 C108.2 317.87,111.91 318.13,111.65 320.68,111.65 320.86,111.83 320.86,112.68 ; U101.50 284.7,137.94 284.7,137.29 285.12,136.88 285.12,135.99 v1(284.78,135.65)
+3V3: length 214.1
  Top Layer w0.254: v1(307.98,139.59) 307.8,139.41 295.91,139.41 295.27,138.77 295.27,135.52 296.29,134.51 v1(299.72,134.51) 299.72,133.87 298.07,132.22 298.07,122.31 299.21,121.17 309.25,121.17 309.42,121.35 v1(309.42,122.19)
  Inner1 w0.254: v1(278.07,120.04) 279.78,121.76 279.78,138.19 v1(279.65,138.32) ; v1(314.67,112.66) 314.67,112.57 316.41,110.83 323.29,110.83 323.47,111.01 323.47,115.46 329.73,121.72 v1(329.73,123.73)
  Inner2 w0.254: v1(305.69,122.28) 305.69,118.76 304.17,117.23 v1(304.17,115.96) ; v1(314.67,112.66) 316.1,112.66 v1(317.75,114.31) ; v1(260.22,137.81) 260.82,137.21 v1(260.82,128.92)
  Bottom Layer w0.254: C112.2 262.61,123.36 261.62,124.35 ; R224.2 314.99,138.4 ; 314.99,138.4 314.99,140.05 315.62,140.69 315.62,148.12 316.23,148.73 324.49,148.73 325.91,147.31 R201.2 328.22,146.8 R202.2 329.1,146.88 C201.2 ; 314.99,138.4 309.16,138.4 v1(307.98,139.59) ; R123.2 260.86,138.44 v1(260.22,137.81) 260.17,137.76 R122.2 ; v1(317.75,114.31) 317.77,114.33 R104.2 ; v1(309.42,122.19) 308.79,121.55 308.32,121.55 ; 309.43,116.14 311.71,116.14 311.89,115.96 C106.2 311.89,113.06 312.29,112.66 v1(314.67,112.66) ; 309.43,116.14 309.43,114.91 C116.2 ; 309.43,116.14 304.27,116.14 304.11,115.98 304.12,115.96 v1(304.17,115.96) ; v1(305.69,122.28) 305.69,121.81 305.94,121.55 308.32,121.55 ; 261.62,124.35 260.8,125.17 C114.2 260.8,128.9 v1(260.82,128.92) ; 261.62,124.35 273.76,124.35 v1(278.07,120.04) ; U101.42 288.45,138.93 288.88,138.93 291.15,136.66 292.23,136.66 293.31,135.58 293.31,134.5 294.26,133.55 294.26,132.96 296.42,132.96 297.18,133.72 298.93,133.72 v1(299.72,134.51) C126.2 ; C102.2 308.32,121.55 ; v1(279.65,138.32) 280.25,138.91 U101.1
+3V3_A: length 33.3
  Inner1 w0.254: v1(297.05,122.95) 296.8,122.95 293.32,126.43 293.32,128.4 287.02,134.7 287.02,135.53 287.3,135.81 287.3,136.3 287.02,136.57 287.02,136.6 v1(287.53,137.11)
  Inner2 w0.254: v1(297.05,122.95) 297.05,122.17 v1(303.24,115.98)
  Bottom Layer w0.254: U101.43 287.53,137.91 v1(287.53,137.11) ; v1(303.24,115.98) 303.24,114.82 303.73,114.33 C105.2
+5V_USB: length 84.5
  Inner1 w0.254: v1(293.88,143.22) 293.88,143.78 294.26,144.16 298.45,144.16 298.69,143.92 v1(298.69,143.31) ; v1(299.85,136.41) 300.61,136.41 302.26,134.76 302.26,132.86 v1(303.91,131.2)
  Inner2 w0.254: v1(299.85,136.41) 299.85,137.17 295.91,141.11 295.03,141.11 294.06,142.08 294.06,143.03 v1(293.88,143.22) ; v1(303.91,131.2) 303.91,129.17 v1(301.12,126.38) v1(269.68,126.38) 269.68,123.77 274.99,118.47 v1(274.99,115.33)
  Bottom Layer w0.254: v1(269.68,126.38) 268.8,127.27 267.21,127.27 267.03,127.09 ; 269.68,126.38 D102.2 ; v1(293.88,143.22) 293.88,143.29 J101.2 ; D101.2 264.16,126.83 264.41,127.09 267.03,127.09 ; 267.03,127.09 267.03,126.54 C118.2 ; 278.07,115.44 275.1,115.44 v1(274.99,115.33)
GND: length 320.5
  Top Layer w0.254: v1(301.62,132.6) 301.99,132.24 304.86,132.24 ; FPC1.8 304.86,132.24 ; 304.86,132.24 305.56,131.53 305.56,125.36 v1(307.59,123.33) ; v1(315.98,114.31) 316.95,113.34 v1(316.95,111.73)
  Inner1 w0.254: 292.99,142.33 291.26,142.33 291.08,142.51 291.08,144.16 289.81,145.43 285.88,145.43 v1(284.77,146.54) ; 292.99,142.33 293.04,142.33 ; 292.99,142.33 293.12,142.45 v1(293.12,143.14) ; v1(307.59,123.33) 308.74,122.19 308.74,115.24 v1(309.79,114.19) 310.3,113.68 312.33,113.68 v1(312.98,114.33) 314.06,113.25 314.91,113.25 316.43,111.73 v1(316.95,111.73) ; v1(265.81,122.19) 265.94,122.31 v1(265.94,125.23) ; 325.12,129.29 330.82,134.99 330.82,136.79 ; 325.12,129.29 325.12,127.78 326.64,126.25 330.71,126.25 330.89,126.07 v1(330.89,123.71) 330.89,122.9 331.34,122.44 331.34,117.23 LED102.2 ; 325.12,129.29 325.12,131.09 319.42,136.79 ; 293.04,142.33 292.86,142.15 v1(292.86,140.51) ; 293.04,142.33 293.88,141.48 307.77,141.48 308.99,142.71 J102.2 ; v1(297.06,131.46) 299.48,131.46 v1(300.62,132.6) 300.62,134.39 v1(300.74,134.51) 298.96,136.28 v1(297.99,136.28) 297.99,136.61 296.93,137.68 v1(296.93,138.82)
  Inner2 w0.254: v1(316.95,111.73) 318.3,110.38 327.28,110.38 327.46,110.56 327.46,113.05 v1(327.31,113.2) ; v1(292.86,140.51) 292.95,140.6 295.15,140.6 v1(296.93,138.82) ; v1(284.77,146.54) 284.73,146.5 277.55,146.5 277.37,146.32 277.37,141.11 276.91,140.66 v1(274.7,140.66)
  Bottom Layer w0.254: C127.1 258.31,144.76 253.94,144.76 ; C108.1 319.02,112.74 319.02,113.55 319.28,113.81 321.49,113.81 321.95,113.34 C109.1 322.6,112.03 327.15,112.03 327.33,112.21 327.33,113.17 v1(327.31,113.2) ; 262.06,132.22 261.91,132.07 C113.1 261.89,128.9 C114.1 262.81,125.56 265.16,125.56 ; 262.06,132.22 262.89,132.22 ; 262.06,132.22 257.94,132.22 253.94,136.22 SW101.1 ; C105.1 308.01,113.3 309.37,113.3 309.79,113.72 v1(309.79,114.19) ; D101.1 265.16,125.56 ; 265.16,125.56 265.48,125.23 v1(265.94,125.23) ; C111.1 300.9,134.81 arc(300.87,134.65) C126.1 v1(300.74,134.51) ; U101.19 283.9,145.08 283.9,145.73 284.12,145.95 284.18,145.95 v1(284.77,146.54) ; D102.1 269.54,125.23 v1(265.94,125.23) ; 274.19,117.62 277.94,117.62 U102.2 U102.4 290.45,124.41 ; 274.19,117.62 270.21,117.62 C112.1 265.8,122.17 v1(265.81,122.19) ; 274.19,117.62 273.95,117.37 273.95,115.22 ; Y101.2 267.74,131.33 Y101.4 ; 290.45,124.41 U104.4 ; 290.45,124.41 290.45,124.22 290.83,123.84 295.91,123.84 297.06,124.99 v1(297.06,131.46) D104.1 ; v1(265.94,125.23) 266.32,125.62 267.33,125.62 267.97,126.25 C118.1 ; C201.1 331.13,137.1 330.82,136.79 ; v1(301.62,132.6) 300.62,132.6 ; J102.2 307.5,143.31 J101.12 ; Y101.4 266,132.98 264.41,132.98 263.69,132.26 C124.2 ; Y101.4 266.14,133.12 C123.2 266.14,138.01 268.1,139.97 SW102.1 ; v1(330.89,123.71) 330.84,123.71 C104.1 ; C115.1 316.01,112.66 v1(316.95,111.73) ; C204.1 320.2,146.95 321.06,146.95 321.31,146.7 321.31,144.92 320.17,143.78 320.17,137.54 319.42,136.79 ; J101.1 293.09,143.17 v1(293.12,143.14) ; C103.1 309.33,123.33 v1(307.59,123.33) C102.1 C101.1 ; C107.1 315.97,114.32 v1(315.98,114.31)
COL0: length 389.3
  Top Layer w0.254: v1(302.13,113.42) 253.75,113.42 v1(251.21,115.96)
  Inner2 w0.254: v1(302.13,113.42) 302.77,113.42 306.32,116.98 v1(306.32,119.14) ; v1(10.57,88.53) 17.81,95.77 44.7,95.77 51.44,102.5 v1(51.44,105.8)
  Bottom Layer w0.254: 13.24,20.84 13.24,29.99 21.37,38.11 15.65,43.83 15.65,71.64 10.57,76.72 v1(10.57,88.53) ; v1(51.44,105.8) 61.59,115.96 v1(251.21,115.96)
COL0_R: length 46.6
  Inner1 w0.254: v1(306.35,120.08) 304.88,121.55 281.81,121.55 280.54,122.82 v1(280.54,136.82)
  Bottom Layer w0.254: v1(280.54,136.82) 280.14,136.82 278.97,137.99 278.97,139.13 279.15,139.31 U101.2
COL1: length 395.3
  Inner1 w0.254: v1(300.1,114.31) 306.96,114.31 307.98,115.33 v1(307.98,119.14) ; v1(30.89,88.41) 30.89,105.58 v1(31.11,105.8)
  Bottom Layer w0.254: R110.2 308,119.17 v1(307.98,119.14) ; v1(300.1,114.31) 254.76,114.31 251.84,117.23 42.55,117.23 v1(31.11,105.8) 31.11,105.84 31.02,105.93 ; 38,20.71 38,28.37 47.37,37.73 55.66,37.73 46.13,47.26 46.13,60.05 40.77,65.42 40.77,71.36 41.31,71.89 30.89,82.31 v1(30.89,88.41)
COL1_R: length 48.4
  Inner1 w0.254: v1(281.69,130.19) 283.08,130.19 v1(290.96,122.31)
  Bottom Layer w0.254: v1(290.96,122.31) 291.34,121.93 304.97,121.93 305.71,121.2 306.89,121.2 R110.1 ; 281.33,139.71 281.31,139.69 277.98,139.69 276.05,137.76 276.05,132.65 276.22,132.47 277.66,132.47 277.69,132.44 278.18,132.44 278.2,132.47 279.4,132.47 v1(281.69,130.19)
COL2: length 446.1
  Top Layer w0.254: v1(309.75,119.14) 309.75,117.23 309.12,116.6 253.49,116.6 v1(251.97,118.12)
  Bottom Layer w0.254: 63.79,20.71 76.69,33.62 76.69,39.78 66.67,49.8 66.67,54.59 66.83,54.75 66.83,59.93 60.58,66.18 60.58,71.23 61.25,71.89 51.13,82.01 51.13,87.81 51.72,88.41 51.72,90.28 46.86,95.14 12.57,95.14 10.7,97.01 10.7,105.8 23.02,118.12 v1(251.97,118.12) ; R112.2 309.68,119.21 v1(309.75,119.14)
COL2_R: length 47.1
  Inner1 w0.254: v1(299.08,127.57) 303.48,127.57 v1(304.67,126.38)
  Inner2 w0.254: v1(299.08,127.57) 296.99,127.57 289,135.56 289,136.73 283.84,141.89 282.08,141.89 281.74,141.55 281.74,141.07 282.63,140.18 282.63,139.22 282.5,139.09 v1(282.39,139.2)
  Bottom Layer w0.254: v1(304.67,126.38) 309.75,126.38 310.39,125.74 310.39,120.54 309.93,120.08 R112.1 ; 282.45,139.2 282.45,139.71 282.05,140.11 281.33,140.11
COL3: length 362.6
  Top Layer w0.254: v1(253.62,105.92) 253.62,109.74 254.13,110.25 310.39,110.25 v1(310.64,110.5)
  Inner1 w0.254: v1(253.62,105.92) 253.62,86.12 239.4,71.89 239.4,61.61 238.12,60.34 187.2,60.34 183.52,56.66 183.52,46.11 162.81,25.41 138.18,25.41 136.4,23.63 v1(136.4,20.21)
  Inner2 w0.254: v1(311.28,119.14) 310.64,118.5 v1(310.64,110.5)
  Bottom Layer w0.254: 71.53,89.67 71.53,81.67 81.57,71.64 81.28,71.36 81.28,62.62 86.77,57.13 86.77,54.75 86.74,54.72 86.74,49.54 96.93,39.35 96.93,30.08 106.81,20.21 v1(136.4,20.21) 136.43,20.21
COL3_R: length 41.3
  Top Layer w0.254: v1(286.67,136) 286.34,136 283.21,139.14 v1(283.21,139.46)
  Inner1 w0.254: v1(295.63,127.18) 297.57,125.23 309.25,125.23 311.46,123.02 v1(311.46,122.06)
  Inner2 w0.254: v1(286.67,136) 286.67,135.37 294.89,127.14 295.78,127.14
  Bottom Layer w0.254: U101.5 282.54,140.51 283.05,140 283.05,139.84 283.04,139.84 283.04,139.63 v1(283.21,139.46) ; R113.1 311.46,120.23 v1(311.46,122.06)
COL4: length 436.8
  Top Layer w0.254: v1(312.93,119.27) 313.18,119.01 313.18,118.5 314.07,117.62 314.07,114.21 312.52,112.66 v1(232.79,112.66)
  Inner1 w0.254: v1(91.47,89.42) 97.57,95.52 147.83,95.52 v1(148.59,96.28) ; v1(212.76,20.97) 155.7,20.97 144.4,9.66 118.36,9.66 116.59,11.44 v1(116.59,37.73)
  Bottom Layer w0.254: v1(148.59,96.28) 230,96.28 232.74,99.02 232.74,112.61 v1(232.79,112.66) ; 116.87,37.99 116.84,37.99 v1(116.59,37.73) 106.97,47.35 106.97,55.73 102.01,60.69 102.01,72.02 91.47,82.56 v1(91.47,89.42) ; v1(312.93,119.27) 312.95,119.24 R208.2
COL4_R: length 63.1
  Top Layer w0.254: v1(279.4,140.44) 278.85,140.44 277.37,138.96 277.37,135.14 277.55,134.96 282.37,134.96 286.32,131.01 286.32,127.46 285.99,127.12 285.99,118.4 286.79,117.59 293.15,117.59 293.22,117.51 302.95,117.51 v1(303.28,117.18)
  Inner1 w0.254: v1(312.68,117.11) 312.17,117.62 312.17,120.03 v1(312.93,120.03)
  Bottom Layer w0.254: U101.6 279.87,140.91 279.64,140.68 279.48,140.68 279.4,140.6 ; v1(312.93,120.03) 312.95,120.05 R208.1 ; v1(303.28,117.18) 312.6,117.18 v1(312.68,117.11)
COL5: length 487.6
  Top Layer w0.254: v1(314.58,119.14) 314.58,114.06 312.17,111.65 214.63,111.65 212.72,109.74 212.72,106.31 v1(212.6,106.19)
  Inner2 w0.254: 230.16,23.76 230.28,23.89 230.28,33.71 231.24,34.66 231.24,35.63 230.28,36.59 230.28,43.29 223.01,50.56 223.01,62.75 220.85,64.91 220.85,71.77 210.44,82.18 210.44,103.9 212.6,106.06 v1(212.6,106.19) ; 230.16,23.76 227.11,26.81 140.59,26.81 137.54,29.86 137.54,37.6 v1(137.29,37.86) ; 230.16,23.76 v1(232.95,20.97)
  Bottom Layer w0.254: 111.66,89.29 111.33,88.96 111.33,82.62 111.51,82.44 111.54,82.44 122.33,71.64 122.05,71.36 122.05,63.51 127.16,58.4 127.16,54.62 126.75,54.21 126.75,48.4 v1(137.29,37.86) ; v1(232.95,20.97) 232.95,24.37 230.76,26.56 211.46,26.56 208.15,23.25 157.35,23.25 154.23,26.38 140.13,26.38 137.16,29.35 137.16,37.73 v1(137.29,37.86) ; v1(137.29,37.86) 137.19,37.86 ; R209.2 314.6,119.16 v1(314.58,119.14)
COL5_R: length 45.5
  Inner2 w0.254: v1(299.97,126.96) 299.97,126.84 299.87,126.73 296.26,126.73 296.21,126.78 296.21,127.42 285.01,138.62 285,138.62 284.98,138.64 284.44,138.64 284.26,138.82 284.26,139.37 v1(282.32,141.31)
  Bottom Layer w0.254: v1(299.97,126.96) 311.96,126.96 314.58,124.35 314.58,120.1 R209.1 ; U101.7 v1(282.32,141.31)
COL6: length 423
  Top Layer w0.254: v1(253.4,20.97) 253.52,21.09 253.52,25.95 255.02,27.44 299.47,27.44 301.12,29.1 317.63,29.1 319.15,30.62 319.15,116.22 v1(316.23,119.14)
  Inner1 w0.254: v1(193.04,105.68) 193.04,82.44 189.36,78.75 144.91,78.75 142.14,75.99 v1(142.14,71.64) ; v1(253.4,20.97) 251.46,22.9 251.46,25.79 251.28,25.97 164.14,25.97 162.56,24.4 v1(157.86,24.4)
  Bottom Layer w0.254: v1(157.86,24.4) 157.13,25.13 157.13,37.73 147.48,47.38 147.48,55.99 142.11,61.35 142.11,71.61 v1(142.14,71.64) 142.14,75.29 138.68,78.75 132.11,78.75 132.11,89.17 ; v1(193.04,105.68) 193.04,105.84 192.94,105.93
COL6_R: length 59.7
  Top Layer w0.254: v1(316.23,121.31) 316.06,121.48 310.56,121.48 309.54,120.46 309.17,120.46 308.79,120.08 308.79,118.56 308.61,118.38 295.72,118.38 v1(288.58,125.52) ; v1(279.4,141.26) 279.17,141.26 276.99,139.08 276.99,133.87 277.17,133.69 280.34,133.69 285.62,128.41
  Bottom Layer w0.254: v1(316.23,121.31) 316.23,120.1 R210.1 ; 281.33,141.71 281.31,141.69 280.66,141.69 280.34,141.36 279.4,141.36 ; 288.54,125.49 288.54,125.55 v1(285.66,128.44)
COL7: length 346.8
  Top Layer w0.254: v1(317.88,119.27) 317.88,119.14 319.66,117.36 319.66,30.15 318.1,28.59 301.37,28.59 299.21,26.43 v1(275.08,26.43)
  Inner1 w0.254: v1(177.93,37.22) 177.93,31.38 182.63,26.68 267.24,26.68 v1(273.08,20.84)
  Inner2 w0.254: v1(275.08,26.43) 273.08,24.43 v1(273.08,20.84) ; v1(152.56,88.79) 152.56,93.77 153.16,94.37 171.45,94.37 172.85,95.77 v1(172.85,106.06)
  Bottom Layer w0.254: v1(152.56,88.79) 152.15,88.37 152.15,81.83 162.34,71.64 162.34,63.35 167.42,58.27 167.42,54.88 167.51,54.78 167.51,48.91 177.93,38.49 v1(177.93,37.22) ; v1(172.85,106.06) 172.76,105.97 172.76,105.92 ; R211.2 317.9,119.25 v1(317.88,119.27)
COL7_R: length 63.4
  Top Layer w0.254: v1(287.4,123.71) 287.53,123.71 293.37,117.87 306.88,117.87 v1(306.96,117.79)
  Bottom Layer w0.254: v1(287.4,123.71) 281.51,129.6 281.44,129.6 278.95,132.09 278.33,132.09 278.32,132.09 277.54,132.09 277.54,132.09 275.84,132.09 275.59,132.35 275.59,132.86 275.7,138.42 279.12,141.85 280.31,141.85 280.57,142.11 281.33,142.11 ; R211.1 317.78,120.2 317.42,120.2 316.99,119.77 316.99,118.37 316.48,117.86 307.03,117.86 v1(306.96,117.79)
COL8: length 322.9
  Top Layer w0.254: v1(319.53,119.14) 320.17,118.5 320.17,29.99 318.26,28.08 301.53,28.08 v1(294.16,20.71)
  Inner1 w0.254: v1(172.75,88.79) 165.13,96.41 153.03,96.41 152.78,96.66 v1(152.78,105.93)
  Bottom Layer w0.254: v1(319.53,119.14) 319.55,119.16 R212.2 ; v1(172.75,88.79) 172.75,81.42 182.53,71.64 182.66,71.64 182.5,71.48 182.5,62.88 187.74,57.64 187.74,47.51 197.39,37.86 197.36,37.83 197.36,28.21 198.37,27.19 287.69,27.19 v1(294.16,20.71) ; v1(152.78,105.93) 152.66,106.05 152.64,106.05
COL8_R: length 64.7
  Inner1 w0.254: v1(283.46,125.23) 283.21,125.23 281.05,127.39 281.05,136.5 281.13,136.57 281.13,137.67 279.81,138.99 279.81,140.02 280.29,140.5 280.29,141.2 279.81,141.68 279.81,142.18 v1(280.06,142.43)
  Inner2 w0.254: v1(297.31,120.16) 288.42,120.16 283.46,125.11 v1(283.46,125.23) ; v1(302.39,120.16) 306.7,124.47 318.39,124.47 319.53,123.33 v1(319.53,121.68)
  Bottom Layer w0.254: v1(280.06,142.43) 280.54,142.91 U101.11 ; R212.1 319.53,120.1 v1(319.53,121.68) ; v1(297.31,120.16) v1(302.39,120.16)
COL9: length 345.6
  Top Layer w0.254: v1(321.18,119.14) 320.55,118.5 320.55,29.86 314.36,23.67 v1(314.36,20.84)
  Inner1 w0.254: v1(314.36,20.84) 308.13,27.06 219.84,27.06 217.3,29.6 v1(217.3,37.6) 217.3,39.64 207.39,49.54 v1(207.39,55.13)
  Bottom Layer w0.254: 132.01,106.05 132.01,96.6 133.48,95.14 186.72,95.14 192.82,89.04 ; v1(321.18,119.14) 321.2,119.16 R213.2 ; 207.68,54.88 207.42,55.13 v1(207.39,55.13) 207.39,57.8 202.44,62.75 202.44,71.61 202.6,71.77 192.79,81.58 192.79,89.04 ; v1(217.3,37.6) 217.33,37.6 217.46,37.48
COL9_R: length 69
  Inner2 w0.254: v1(284.73,125.36) 287.02,123.08 295.66,123.08 297.43,124.85 320.04,124.85 321.18,123.71 v1(321.18,121.68)
  Bottom Layer w0.254: v1(284.73,125.36) 278.51,131.59 275.72,131.59 275.21,132.09 275.21,138.45 280.05,143.29 281.31,143.29 U101.12 ; R213.1 321.18,120.1 v1(321.18,121.68)
COL10: length 318.5
  Top Layer w0.254: v1(322.2,96.79) 322.2,118.5 v1(322.83,119.14) ; v1(111.77,106.05) 111.77,95.38 111.89,95.26 213.74,95.26 214.25,94.75 214.25,94.5 212.98,93.23 v1(212.98,88.79)
  Inner2 w0.254: v1(223.17,71.64) 230.41,78.88 280.67,78.88 284.1,82.31 v1(284.1,89.17)
  Bottom Layer w0.254: v1(322.2,96.79) 292.13,96.79 284,88.66 ; 238.03,37.6 228.25,47.38 228.25,60.81 222.76,66.31 222.76,71.23 v1(223.17,71.64) 223.17,73.39 212.6,83.96 212.6,88.12 213.01,88.53 212.98,88.56 v1(212.98,88.79)
COL10_R: length 62.6
  Inner2 w0.254: v1(279.65,144.67) 280.16,145.17 302.01,145.17 305.18,142 312.42,142 315.09,139.33 315.09,130.7 322.71,123.08 v1(322.71,121.81)
  Bottom Layer w0.254: 281.33,143.71 280.69,143.71 279.73,144.67 v1(279.65,144.67) ; v1(322.71,121.81) 322.71,120.22 R214.1
COL11: length 347.8
  Top Layer w0.254: v1(324.61,77.23) 324.61,119.01 v1(324.46,119.16) ; v1(91.69,105.42) 91.69,98.06 95.38,94.37 v1(212.34,94.37)
  Inner1 w0.254: v1(264.19,37.6) 274.95,48.37 274.95,57.92 288.67,71.64 v1(289.56,71.64)
  Inner2 w0.254: v1(233.33,88.91) 233.33,91.8 230.38,94.75 212.72,94.75 v1(212.34,94.37)
  Bottom Layer w0.254: v1(233.33,88.91) 233.33,81.67 243.11,71.89 243.11,60.08 248.32,54.88 248.32,47.35 258.06,37.6 v1(264.19,37.6) ; v1(324.61,77.23) 295.15,77.23 v1(289.56,71.64) 289.43,71.51 289.34,71.51 ; v1(91.69,105.42) 91.69,105.71 91.9,105.92
COL11_R: length 68.6
  Top Layer w0.254: v1(279.53,145.68) 279.78,145.68 288.39,137.07 292.33,137.07 293.83,135.57 293.83,132.49 297.71,128.6 297.71,122.17 299.06,120.81 309.39,120.81 310.03,121.46 310.03,121.72 310.26,121.94 310.26,122.43 311.04,123.2 324.49,123.2 324.66,123.02 324.66,122.06 v1(324.41,121.81)
  Bottom Layer w0.254: 281.33,144.11 281.51,144.29 281.51,144.54 280.37,145.68 v1(279.53,145.68) ; v1(324.41,121.81) 324.41,120.17 R215.1
COL12: length 449.6
  Top Layer w0.254: v1(252.78,89.29) 252.78,93.68 249.17,97.3 v1(168.28,97.3) ; v1(328.8,72.75) 328.8,115.84 326.15,118.49 v1(326.15,119.21)
  Inner1 w0.254: v1(11.97,131.97) 11.97,115.68 15.24,112.41 67.44,112.41 71.75,108.09 v1(71.75,105.42)
  Inner2 w0.254: v1(168.28,97.3) 79.88,97.3 74.95,102.22 73.18,102.22 72.5,102.91 72.5,104.68 v1(71.75,105.42)
  Bottom Layer w0.254: v1(252.78,89.29) 253.49,88.59 253.49,86.37 263.07,76.8 263.07,72.13 v1(263.43,71.77) 263.43,63.23 271.91,54.75 277.53,54.75 277.53,44.43 283.85,38.11 293.4,38.11 293.78,37.73 293.78,39.89 326.64,72.75 v1(328.8,72.75) ; 71.4,105.92 71.75,105.56 v1(71.75,105.42)
COL12_R: length 106.2
  Top Layer w0.254: v1(330.2,110.25) 330.2,115.46 v1(327.91,117.74)
  Inner1 w0.254: v1(330.2,110.25) 329.44,109.49 287.15,109.49 272.92,123.71 v1(272.92,135.65)
  Bottom Layer w0.254: v1(272.92,135.65) 272.92,137.05 277.24,141.36 277.24,146.19 277.5,146.44 281.81,146.44 282.28,145.98 U101.15 ; R216.1 326.2,120.03 327.41,120.03 327.59,119.85 327.59,118.07 v1(327.91,117.74)
CON_USB_N: length 10
  Bottom Layer w0.254: 296.54,142.54 296.48,142.48 295.78,142.48 295.61,142.64 295.61,143.24 J101.5 ; 296.54,142.54 296.54,140.22 D103.2 299.98,138.82 300.48,138.32 300.48,138.24 R109.1 ; 296.54,142.54 J101.7
CON_USB_P: length 23.6
  Bottom Layer w0.254: 300.79,140.47 R111.1 ; 300.79,140.47 300.79,141.62 297.56,141.62 297.05,142.13 297.05,143.31 J101.8 297.11,143.37 297.11,143.98 296.93,144.16 296.21,144.16 296.04,143.98 J101.6 ; 300.79,140.47 302.77,140.47 302.77,133.36 298.89,133.36 298.89,132.6 D104.2
CS: length 23.9
  Top Layer w0.254: FPC1.5 305.19,133.74 v1(305.05,133.87)
  Inner2 w0.254: v1(289.56,142.51) 289.94,142.51 293.24,139.2 295.02,139.2 296.55,137.68 296.55,135.27 297.71,134.1 298.72,134.1 298.95,133.87 v1(305.05,133.87)
  Bottom Layer w0.254: v1(289.56,142.51) 289.48,142.51 289.1,142.89 288.45,142.89 U101.32
ENC1_A: length 8.6
  Inner1 w0.254: v1(290.27,144.08) 290.33,144.02 290.33,140.33 291.13,139.53
  Bottom Layer w0.254: R205.1 291.32,139.42 C203.2 ; v1(290.27,144.08) 289.45,144.08 289.1,143.73 288.45,143.73
  vias: v1(291.21,139.54)
ENC1_B: length 36.4
  Top Layer w0.254: R207.1 v1(320.13,145.81) 319.15,145.81 315.01,141.67 291.41,141.67 v1(289.75,143.33)
  Bottom Layer w0.254: v1(289.75,143.33) 289.73,143.31 U101.31
QSPI_SCLK: length 12.2
  Bottom Layer w0.254: U104.6 291.72,134.38 291.36,134.74 284.63,134.74 283.88,135.49 U101.52
QSPI_SD0: length 11.2
  Bottom Layer w0.254: U104.5 290.45,134.12 290.19,134.38 284.48,134.38 283.5,135.36 283.5,137.94 U101.53
QSPI_SD1: length 19.8
  Inner2 w0.254: v1(292.74,128.16) 286.89,134 282.07,134 281.89,134.18 281.89,135.98 v1(282.45,136.54)
  Bottom Layer w0.254: U101.55 282.66,137.94 282.66,137.26 282.45,137.05 v1(282.45,136.54) ; v1(292.74,128.16) 292.99,127.9 U104.2
QSPI_SD2: length 16.2
  Inner1 w0.254: 283.08,135.78 290.83,128.03 v1(291.72,128.03)
  Bottom Layer w0.254: U104.3 v1(291.72,128.03) ; v1(282.92,135.78) 283.08,135.94 U101.54
QSPI_SD3: length 12.8
  Top Layer w0.254: v1(284.46,136.41) 284.49,136.44 285.41,136.44 287.34,134.51 292.74,134.51 292.99,134.25 v1(292.99,132.73)
  Bottom Layer w0.254: v1(292.99,132.73) U104.7 ; U101.51 284.3,137.94 284.3,137.19 284.46,137.03 v1(284.46,136.41)
QSPI_SS: length 45.5
  Inner1 w0.254: v1(278.38,136.92) 264.67,136.92 263.35,135.6 v1(257.3,135.6)
  Bottom Layer w0.254: 281.86,135.85 281.86,136.97 282.28,137.39 U101.56 ; 281.86,135.85 279.45,135.85 v1(278.38,136.92) ; 281.86,135.85 287.91,129.81 292.35,129.81 294.26,127.9 294.26,125.9
RESET_N: length 32.9
  Top Layer w0.254: v1(286.89,146.7) 285.5,148.09 278.26,148.09 v1(275.97,145.81)
  Bottom Layer w0.254: R125.2 260.02,141.92 260.64,142.54 C127.2 262.93,145.81 v1(275.97,145.81) ; v1(286.89,146.7) 286.89,146.32 286.66,146.08 286.66,145.08 U101.26
ROW0: length 351.4
  Inner1 w0.254: v1(238.38,98.31) 238.25,98.44 v1(218.03,98.44) ; v1(138.3,98.31) v1(136.7,96.71) v1(117.45,96.71)
  Inner2 w0.254: v1(326.01,99.2) 328.8,101.99 v1(328.8,119.14)
  Bottom Layer w0.254: v1(328.8,119.14) 328.8,119.2 R217.2 ; v1(218.03,98.44) 217.98,98.39 217.98,97.02 217.81,96.84 198.42,96.84 D225.1 196.54,97.15 178.36,97.15 ; D214.1 v1(238.38,98.31) 239.43,98.31 240.08,97.66 245.59,97.66 246.25,98.31 D213.1 261.01,98.31 261.67,97.66 265.91,97.66 266.57,98.31 325.12,98.31 v1(326.01,99.2) ; 97.92,97.04 98.25,96.71 v1(117.45,96.71) 118.59,97.85 D238.1 ; 97.92,97.04 82.07,97.04 82.05,97.02 79.75,97.02 D249.1 78.2,96.79 58.93,96.79 57.67,98.04 57.67,98.07 ; 97.92,97.04 98.1,97.22 98.1,98.39 D239.1 ; 178.36,97.15 178.36,97.76 D226.1 ; 178.36,97.15 178.36,96.81 178.18,96.64 160.52,96.64 D227.1 157.83,97.55 148.72,97.55 147.88,96.71 v1(136.7,96.71) ; 57.67,98.07 D201.1 ; 57.67,98.07 56.64,97.04 38.68,97.04 D202.1 36.79,98.15 35.18,96.53 16.79,96.53 D203.1 ; v1(138.3,98.31) D237.1
ROW0_R: length 117.4
  Inner1 w0.254: v1(272.03,135.78) 272.03,109.61 v1(272.41,109.23)
  Inner2 w0.254: v1(281.31,147.51) 274.5,147.51 272.03,145.05 v1(272.03,135.78)
  Bottom Layer w0.254: v1(272.41,109.23) 273.43,108.22 325.75,108.22 328.95,111.42 328.95,118.24 329.68,118.96 329.68,120.07 328.79,120.07 R217.1 ; v1(281.31,147.51) 281.31,147.5 282.66,146.15 282.66,145.08 U101.16
ROW1: length 359.6
  Inner1 w0.254: v1(15.97,81.29) 16.48,80.78 36.32,80.78 36.58,80.53 54.36,80.53 54.89,80 55.51,80 55.72,80.21 55.72,80.91 55.6,81.04 ; 55.6,81.04 v1(55.47,81.17) ; 55.6,81.04 76.2,81.04 v1(76.96,81.8) 78.36,80.4 97.54,80.4 98.17,81.04 v1(98.17,81.55) 117.35,81.55 v1(117.6,81.8) 118.75,80.66 134.87,80.66 ; 134.87,80.66 135.51,81.29 v1(135.51,82.06) ; 134.87,80.66 155.07,80.66 ; v1(198.25,82.06) 200.41,79.9 218.69,79.9 ; 155.07,80.66 v1(176.02,80.66) v1(177.16,81.8) ; 155.07,80.66 v1(156.46,82.06) ; 218.69,79.9 218.95,80.15 v1(218.95,82.06) ; 218.69,79.9 v1(239.27,79.9) 239.9,80.53 v1(239.9,82.06)
  Inner2 w0.254: v1(260.86,82.06) 260.86,80.91 259.84,79.9 v1(239.27,79.9) ; v1(198.25,82.06) 196.85,80.66 v1(176.02,80.66)
  Bottom Layer w0.254: R218.2 329.31,118.09 329.31,100.98 326.29,97.95 289.2,97.95 271.91,80.66 261.11,80.66 260.86,80.91 v1(260.86,82.06) ; D242.1 239.9,82.05 v1(239.9,82.06) ; v1(98.17,81.55) 98.17,81.64 D217.1 ; 16,80.91 15.97,80.94 v1(15.97,81.29) ; v1(117.6,81.8) D218.1 ; v1(135.51,82.06) 135.5,82.06 D228.1 ; D230.1 177.25,81.89 v1(177.16,81.8)
  vias: v1(36.42,80.92)
ROW1_R: length 72.7
  Top Layer w0.254: v1(293.62,147.03) 293.29,146.7 290.7,146.7 288.67,148.73 v1(283.72,148.73)
  Inner2 w0.254: v1(312.93,139.71) 312.93,138.61 v1(310.21,135.89)
  Bottom Layer w0.254: U101.17 283.08,148.09 v1(283.72,148.73) ; v1(312.93,139.71) 313.11,139.89 313.11,145.76 311.91,146.95 311.66,146.95 311.61,146.9 311.07,146.9 311.04,146.93 301.03,146.93 300.98,146.88 300.25,146.88 300.23,146.9 293.62,146.9 ; v1(310.21,135.89) 323.71,122.39 328.12,122.39 R218.1
ROW2: length 377.4
  Inner1 w0.254: 86.36,61.99 107.19,61.99 ; 86.36,61.99 87,62.62 87,64.02 v1(87.12,64.15) ; 86.36,61.99 64.9,61.99 ; 107.19,61.99 127.64,61.99 ; 107.19,61.99 107.95,62.75 v1(107.95,64.15) ; 46.48,61.99 23.97,61.99 v1(21.81,64.15) ; 46.48,61.99 47.37,62.88 v1(47.37,64.15) ; 46.48,61.99 64.9,61.99 ; 147.07,61.99 168.15,61.99 ; 147.07,61.99 127.64,61.99 ; 147.07,61.99 148.08,63 v1(148.08,64.15) ; 168.15,61.99 168.91,62.75 v1(168.91,64.15) ; 168.15,61.99 189.23,61.99 ; 64.9,61.99 66.29,63.39 v1(66.29,64.28) ; 127.64,61.99 128.91,63.26 v1(128.91,64.02) ; v1(189.76,64.15) 189.76,62.52 189.23,61.99 ; v1(229.11,63.77) 229.11,62.37 v1(228.73,61.99) 207.9,61.99 ; 207.9,61.99 189.23,61.99 ; 207.9,61.99 208.28,62.37 v1(208.28,63.77)
  Inner2 w0.254: v1(331.72,95.39) 310.01,95.39 276.61,61.99 269.11,61.99 ; 249.3,61.99 269.11,61.99 ; 249.3,61.99 v1(249.94,62.62) ; 249.3,61.99 v1(228.73,61.99) ; 269.11,61.99 v1(270.89,63.77)
  Bottom Layer w0.254: R219.2 331.72,118.85 v1(331.72,95.39) ; v1(249.94,62.62) 250.06,62.74 D245.1
ROW2_R: length 71.7
  Top Layer w0.254: v1(315.98,131.97) 317.5,133.49 v1(317.5,142.25)
  Inner2 w0.254: v1(289.56,148.86) 289.56,148.22 291.46,146.32 313.44,146.32 v1(317.5,142.25)
  Bottom Layer w0.254: R219.1 332.09,120.46 329.77,122.77 325.55,122.77 316.36,131.97 v1(315.98,131.97) ; v1(289.56,148.86) 285.88,148.86 283.48,146.45 U101.18
